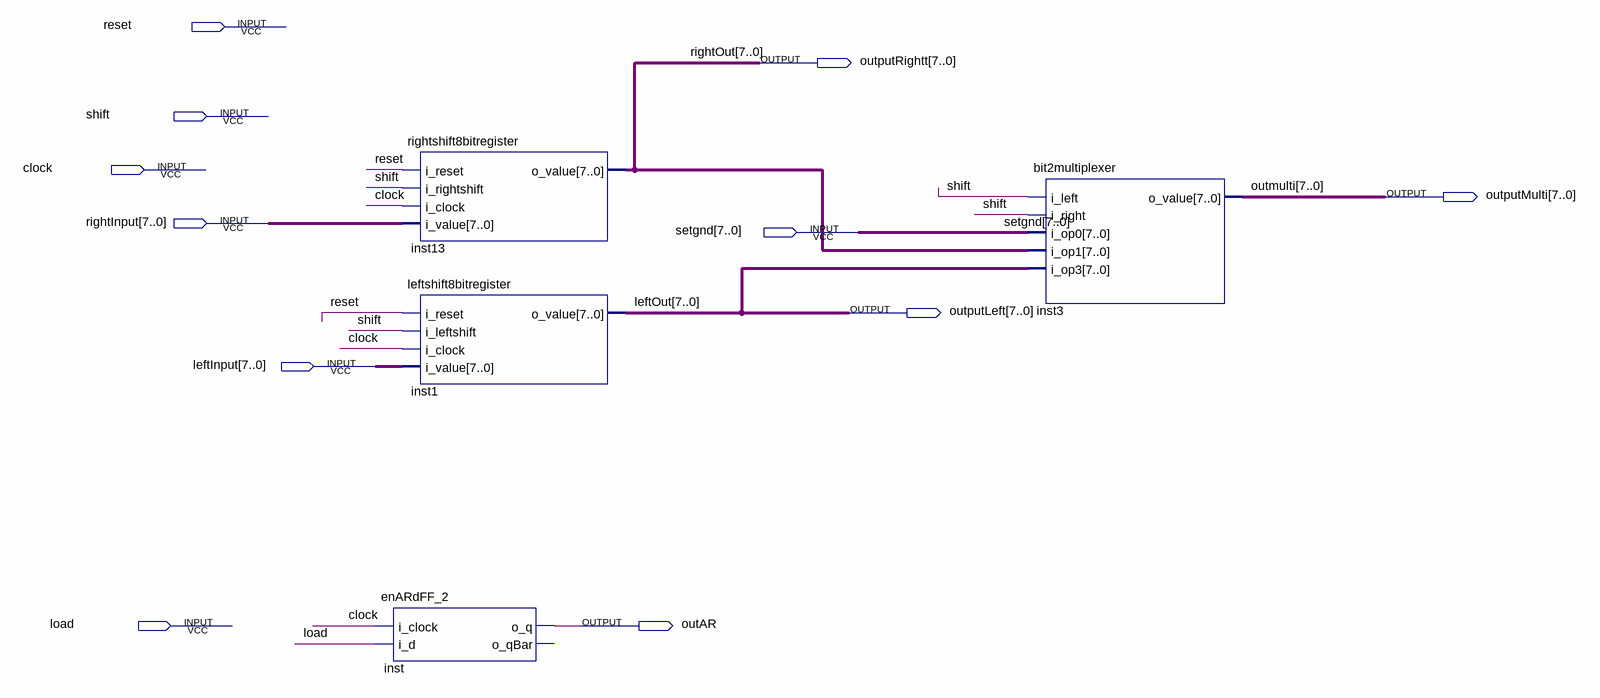
[diagram p0: schematic sheet]
// Quartus schematic testLab.bdf as structural Verilog: 4 symbols, 11 pins
module testLab (
  input  reset,
  input  shift,
  input  clock,
  input  [7:0] rightInput,
  input  [7:0] setgnd,
  input  [7:0] leftInput,
  input  load,
  output [7:0] outputRightt,
  output [7:0] outputMulti,
  output [7:0] outputLeft,
  output outAR
);

  rightshift8bitregister inst13 (
    .i_reset(reset), .i_rightshift(shift), .i_clock(clock), .i_value(rightInput), .o_value(outputRightt));
  leftshift8bitregister inst1 (
    .i_reset(reset), .i_leftshift(shift), .i_clock(clock), .i_value(leftInput), .o_value(outputLeft));
  enARdFF_2 inst (.i_clock(clock), .i_d(load), .o_q(outAR));  // open: o_qBar
  bit2multiplexer inst3 (
    .i_left(shift), .i_right(shift), .i_op0(setgnd), .i_op1(outputRightt), .i_op3(outputLeft),
    .o_value(outputMulti));

  // Other names for the same wires on the sheet: leftOut[7:0] = outputLeft; outmulti[7:0] = outputMulti;
  //   rightOut[7:0] = outputRightt
endmodule
